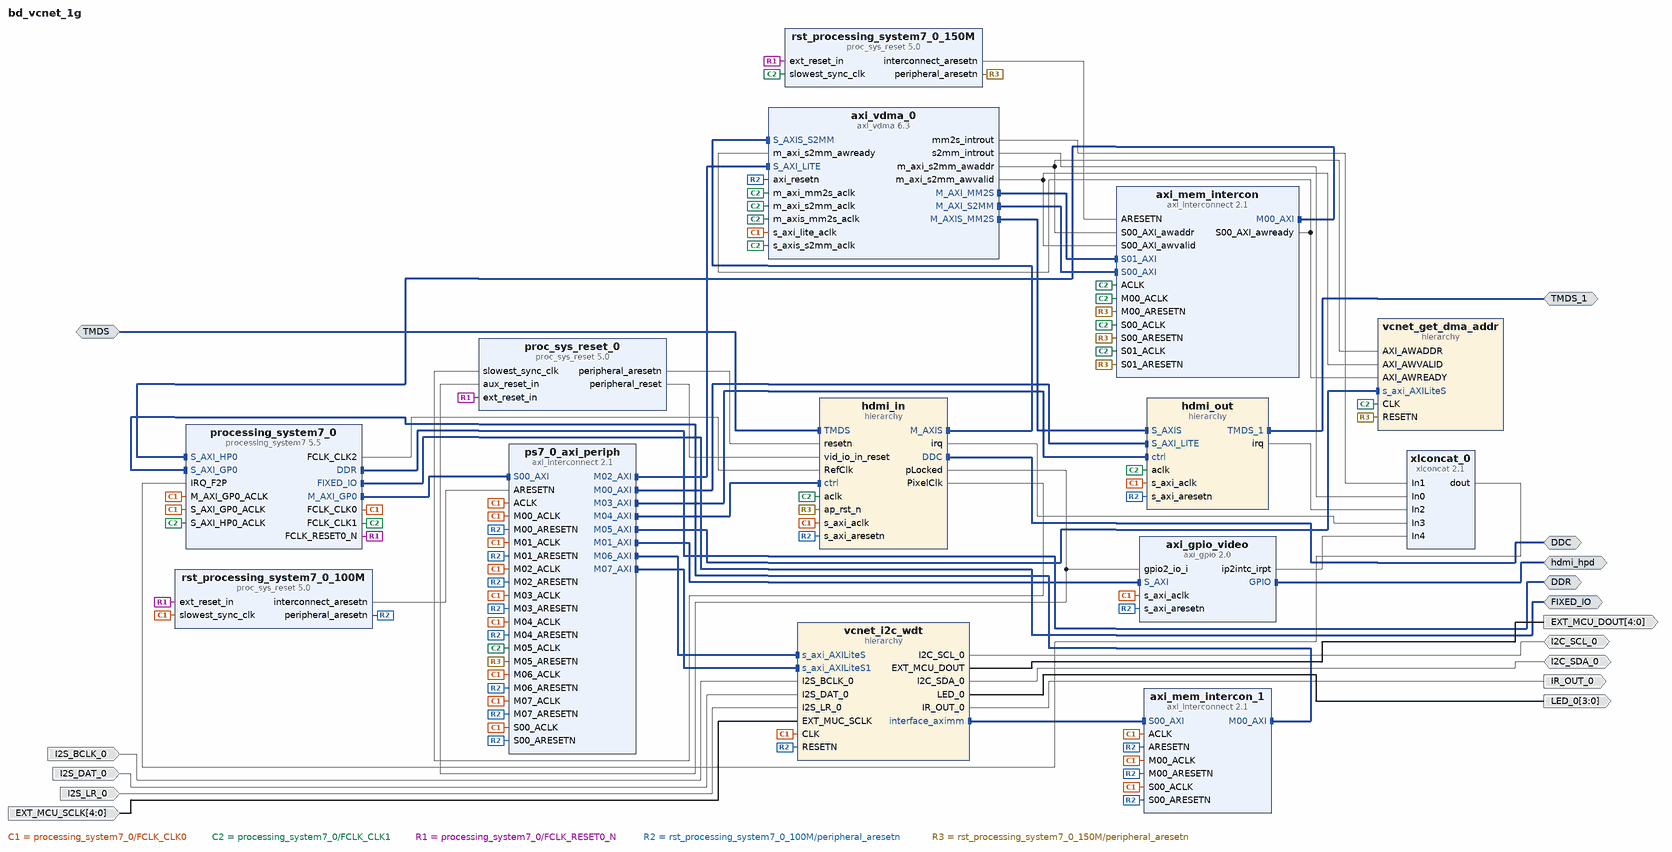
[diagram p0: block diagram of the top level]
# Vivado block design bd_vcnet_1g, xc7z010clg400-1, Vivado 2021.2
create_bd_design bd_vcnet_1g

create_bd_intf_port -mode Master -vlnv xilinx.com:interface:iic_rtl:1.0 DDC
create_bd_intf_port -mode Master -vlnv xilinx.com:interface:ddrx_rtl:1.0 DDR
create_bd_intf_port -mode Master -vlnv xilinx.com:display_processing_system7:fixedio_rtl:1.0 FIXED_IO
create_bd_intf_port -mode Slave -vlnv digilentinc.com:interface:tmds_rtl:1.0 TMDS
create_bd_intf_port -mode Master -vlnv digilentinc.com:interface:tmds_rtl:1.0 TMDS_1
create_bd_intf_port -mode Master -vlnv xilinx.com:interface:gpio_rtl:1.0 hdmi_hpd
create_bd_port -dir O -from 4 -to 0 EXT_MCU_DOUT
create_bd_port -dir I -from 4 -to 0 EXT_MCU_SCLK
create_bd_port -dir IO I2C_SCL_0
create_bd_port -dir IO I2C_SDA_0
create_bd_port -dir I I2S_BCLK_0
create_bd_port -dir I I2S_DAT_0
create_bd_port -dir I I2S_LR_0
create_bd_port -dir O IR_OUT_0
create_bd_port -dir O -from 3 -to 0 LED_0

create_bd_cell -type ip -vlnv xilinx.com:ip:axi_gpio:2.0 axi_gpio_video
set_property -dict [list \
  CONFIG.C_ALL_INPUTS_2 1 \
  CONFIG.C_ALL_OUTPUTS 1 \
  CONFIG.C_GPIO2_WIDTH 1 \
  CONFIG.C_GPIO_WIDTH 1 \
  CONFIG.C_INTERRUPT_PRESENT 1 \
  CONFIG.C_IS_DUAL 1 \
] [get_bd_cells axi_gpio_video]
create_bd_cell -type ip -vlnv xilinx.com:ip:axi_interconnect:2.1 axi_mem_intercon
set_property -dict [list \
  CONFIG.M00_HAS_DATA_FIFO 2 \
  CONFIG.M00_HAS_REGSLICE 4 \
  CONFIG.NUM_MI 1 \
  CONFIG.NUM_SI 2 \
  CONFIG.S00_HAS_DATA_FIFO 2 \
  CONFIG.S00_HAS_REGSLICE 4 \
  CONFIG.S01_HAS_DATA_FIFO 2 \
  CONFIG.S01_HAS_REGSLICE 4 \
  CONFIG.STRATEGY 0 \
  CONFIG.SYNCHRONIZATION_STAGES 2 \
] [get_bd_cells axi_mem_intercon]
create_bd_cell -type ip -vlnv xilinx.com:ip:axi_interconnect:2.1 axi_mem_intercon_1
set_property -dict {CONFIG.NUM_MI 1} [get_bd_cells axi_mem_intercon_1]
create_bd_cell -type ip -vlnv xilinx.com:ip:axi_vdma:6.3 axi_vdma_0
set_property -dict [list \
  CONFIG.c_include_mm2s_dre 0 \
  CONFIG.c_include_s2mm_dre 0 \
  CONFIG.c_m_axi_mm2s_data_width 32 \
  CONFIG.c_m_axis_mm2s_tdata_width 24 \
  CONFIG.c_mm2s_genlock_mode 0 \
  CONFIG.c_mm2s_linebuffer_depth 2048 \
  CONFIG.c_mm2s_max_burst_length 32 \
  CONFIG.c_num_fstores 3 \
  CONFIG.c_s2mm_genlock_mode 0 \
  CONFIG.c_s2mm_linebuffer_depth 2048 \
  CONFIG.c_s2mm_max_burst_length 32 \
  CONFIG.c_use_s2mm_fsync 2 \
] [get_bd_cells axi_vdma_0]
create_bd_cell -type hier hdmi_in
create_bd_cell -type hier hdmi_out
create_bd_cell -type ip -vlnv xilinx.com:ip:proc_sys_reset:5.0 proc_sys_reset_0
set_property -dict {CONFIG.C_AUX_RESET_HIGH 0 CONFIG.C_EXT_RST_WIDTH 4} [get_bd_cells proc_sys_reset_0]
create_bd_cell -type ip -vlnv xilinx.com:ip:processing_system7:5.5 processing_system7_0
set_property -dict [list \
  CONFIG.PCW_APU_PERIPHERAL_FREQMHZ 650 \
  CONFIG.PCW_CRYSTAL_PERIPHERAL_FREQMHZ 50.000000 \
  CONFIG.PCW_ENET0_ENET0_IO {MIO 16 .. 27} \
  CONFIG.PCW_ENET0_GRP_MDIO_ENABLE 1 \
  CONFIG.PCW_ENET0_GRP_MDIO_IO {MIO 52 .. 53} \
  CONFIG.PCW_ENET0_PERIPHERAL_ENABLE 1 \
  CONFIG.PCW_ENET0_RESET_ENABLE 1 \
  CONFIG.PCW_ENET0_RESET_IO {MIO 9} \
  CONFIG.PCW_ENET_RESET_ENABLE 1 \
  CONFIG.PCW_ENET_RESET_SELECT {Share reset pin} \
  CONFIG.PCW_EN_CLK1_PORT 1 \
  CONFIG.PCW_EN_CLK2_PORT 1 \
  CONFIG.PCW_FCLK_CLK1_BUF TRUE \
  CONFIG.PCW_FCLK_CLK2_BUF TRUE \
  CONFIG.PCW_FPGA0_PERIPHERAL_FREQMHZ 100 \
  CONFIG.PCW_FPGA1_PERIPHERAL_FREQMHZ 140 \
  CONFIG.PCW_FPGA2_PERIPHERAL_FREQMHZ 200 \
  CONFIG.PCW_FPGA_FCLK1_ENABLE 1 \
  CONFIG.PCW_FPGA_FCLK2_ENABLE 1 \
  CONFIG.PCW_GP0_EN_MODIFIABLE_TXN 0 \
  CONFIG.PCW_GP1_EN_MODIFIABLE_TXN 0 \
  CONFIG.PCW_GPIO_MIO_GPIO_ENABLE 1 \
  CONFIG.PCW_GPIO_MIO_GPIO_IO MIO \
  CONFIG.PCW_I2C0_I2C0_IO EMIO \
  CONFIG.PCW_I2C0_PERIPHERAL_ENABLE 1 \
  CONFIG.PCW_I2C1_I2C1_IO EMIO \
  CONFIG.PCW_I2C1_PERIPHERAL_ENABLE 1 \
  CONFIG.PCW_I2C_PERIPHERAL_FREQMHZ 108.333336 \
  CONFIG.PCW_I2C_RESET_ENABLE 1 \
  CONFIG.PCW_I2C_RESET_SELECT {Share reset pin} \
  CONFIG.PCW_IRQ_F2P_INTR 1 \
  CONFIG.PCW_PERIPHERAL_BOARD_PRESET part0 \
  CONFIG.PCW_PRESET_BANK1_VOLTAGE {LVCMOS 1.8V} \
  CONFIG.PCW_QSPI_GRP_FBCLK_ENABLE 1 \
  CONFIG.PCW_QSPI_GRP_FBCLK_IO {MIO 8} \
  CONFIG.PCW_QSPI_GRP_SINGLE_SS_ENABLE 1 \
  CONFIG.PCW_QSPI_GRP_SINGLE_SS_IO {MIO 1 .. 6} \
  CONFIG.PCW_QSPI_PERIPHERAL_ENABLE 1 \
  CONFIG.PCW_QSPI_QSPI_IO {MIO 1 .. 6} \
  CONFIG.PCW_SD0_GRP_CD_ENABLE 1 \
  CONFIG.PCW_SD0_GRP_CD_IO {MIO 47} \
  CONFIG.PCW_SD0_GRP_WP_ENABLE 1 \
  CONFIG.PCW_SD0_GRP_WP_IO EMIO \
  CONFIG.PCW_SD0_PERIPHERAL_ENABLE 1 \
  CONFIG.PCW_SD0_SD0_IO {MIO 40 .. 45} \
  CONFIG.PCW_SDIO_PERIPHERAL_FREQMHZ 50 \
  CONFIG.PCW_SINGLE_QSPI_DATA_MODE x4 \
  CONFIG.PCW_UART0_PERIPHERAL_ENABLE 1 \
  CONFIG.PCW_UART0_UART0_IO {MIO 14 .. 15} \
  CONFIG.PCW_UART1_PERIPHERAL_ENABLE 0 \
  CONFIG.PCW_UART_PERIPHERAL_FREQMHZ 100 \
  CONFIG.PCW_UIPARAM_DDR_BUS_WIDTH {16 Bit} \
  CONFIG.PCW_UIPARAM_DDR_FREQ_MHZ 525 \
  CONFIG.PCW_UIPARAM_DDR_PARTNO {MT41K256M16 RE-125} \
  CONFIG.PCW_USB0_PERIPHERAL_ENABLE 1 \
  CONFIG.PCW_USB0_RESET_ENABLE 1 \
  CONFIG.PCW_USB0_RESET_IO {MIO 46} \
  CONFIG.PCW_USB0_USB0_IO {MIO 28 .. 39} \
  CONFIG.PCW_USB_RESET_ENABLE 1 \
  CONFIG.PCW_USB_RESET_SELECT {Share reset pin} \
  CONFIG.PCW_USE_FABRIC_INTERRUPT 1 \
  CONFIG.PCW_USE_S_AXI_GP0 1 \
  CONFIG.PCW_USE_S_AXI_HP0 1 \
  CONFIG.preset Default \
] [get_bd_cells processing_system7_0]
# 508 more settings of processing_system7_0 are not shown: defaults, MIO pin electricals, DDR timing, and values the tool derives
create_bd_cell -type ip -vlnv xilinx.com:ip:axi_interconnect:2.1 ps7_0_axi_periph
set_property -dict {CONFIG.NUM_MI 8 CONFIG.SYNCHRONIZATION_STAGES 2} [get_bd_cells ps7_0_axi_periph]
create_bd_cell -type ip -vlnv xilinx.com:ip:proc_sys_reset:5.0 rst_processing_system7_0_100M
create_bd_cell -type ip -vlnv xilinx.com:ip:proc_sys_reset:5.0 rst_processing_system7_0_150M
create_bd_cell -type hier vcnet_get_dma_addr
create_bd_cell -type hier vcnet_i2c_wdt
create_bd_cell -type ip -vlnv xilinx.com:ip:xlconcat:2.1 xlconcat_0
set_property -dict {CONFIG.NUM_PORTS 5 CONFIG.dout_width 5} [get_bd_cells xlconcat_0]

# ---- hierarchy /hdmi_in ----
current_bd_instance /hdmi_in
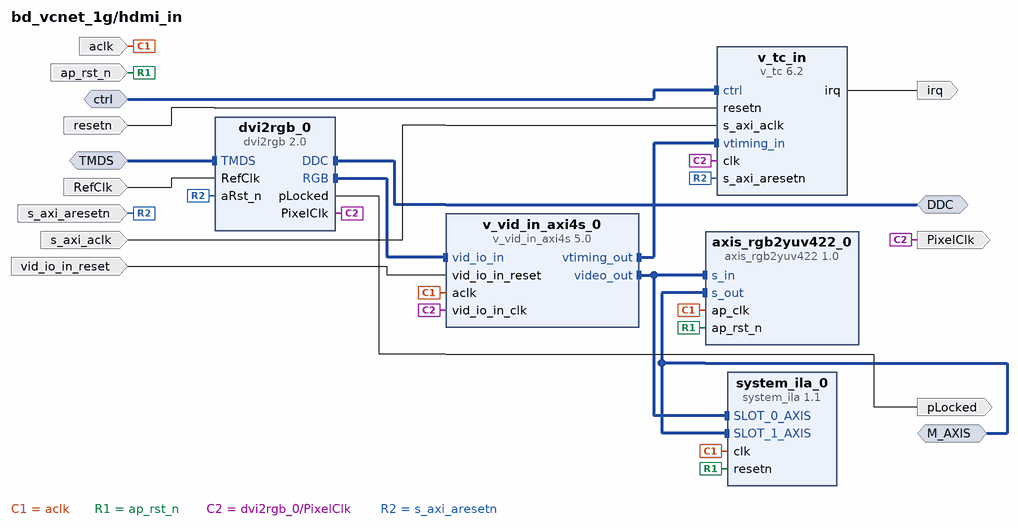
[diagram p1: block diagram inside /hdmi_in]
create_bd_intf_pin -mode Master -vlnv xilinx.com:interface:axis_rtl:1.0 M_AXIS
create_bd_intf_pin -mode Slave -vlnv xilinx.com:interface:aximm_rtl:1.0 ctrl
create_bd_intf_pin -mode Slave -vlnv digilentinc.com:interface:tmds_rtl:1.0 TMDS
create_bd_intf_pin -mode Master -vlnv xilinx.com:interface:iic_rtl:1.0 DDC
create_bd_pin -dir I -type clk aclk
create_bd_pin -dir I -type clk s_axi_aclk
create_bd_pin -dir I -type rst s_axi_aresetn
create_bd_pin -dir O -type intr irq
create_bd_pin -dir I -type rst resetn
create_bd_pin -dir I -type rst vid_io_in_reset
create_bd_pin -dir I -type clk RefClk
create_bd_pin -dir O pLocked
create_bd_pin -dir O -type clk PixelClk
create_bd_pin -dir I -type rst ap_rst_n

create_bd_cell -type ip -vlnv xilinx.com:ip:v_tc:6.2 v_tc_in
set_property -dict [list \
  CONFIG.HAS_INTC_IF true \
  CONFIG.VIDEO_MODE 720p \
  CONFIG.enable_generation false \
  CONFIG.horizontal_blank_detection false \
  CONFIG.max_lines_per_frame 2048 \
  CONFIG.vertical_blank_detection false \
] [get_bd_cells v_tc_in]
create_bd_cell -type ip -vlnv xilinx.com:ip:v_vid_in_axi4s:5.0 v_vid_in_axi4s_0
set_property -dict {CONFIG.C_ADDR_WIDTH 12 CONFIG.C_HAS_ASYNC_CLK 1} [get_bd_cells v_vid_in_axi4s_0]
create_bd_cell -type ip -vlnv digilentinc.com:ip:dvi2rgb:2.0 dvi2rgb_0
set_property -dict [list \
  CONFIG.kAddBUFG false \
  CONFIG.kDebug false \
  CONFIG.kEmulateDDC true \
  CONFIG.kEnableSerialClkOutput false \
  CONFIG.kRstActiveHigh false \
] [get_bd_cells dvi2rgb_0]
create_bd_cell -type ip -vlnv xilinx.com:hls:axis_rgb2yuv422:1.0 axis_rgb2yuv422_0
create_bd_cell -type ip -vlnv xilinx.com:ip:system_ila:1.1 system_ila_0
set_property -dict [list \
  CONFIG.C_DATA_DEPTH 4096 \
  CONFIG.C_NUM_MONITOR_SLOTS 2 \
  CONFIG.C_SLOT 1 \
  CONFIG.C_SLOT_0_INTF_TYPE xilinx.com:interface:axis_rtl:1.0 \
  CONFIG.C_SLOT_1_INTF_TYPE xilinx.com:interface:axis_rtl:1.0 \
] [get_bd_cells system_ila_0]

# ---- hierarchy /hdmi_out ----
current_bd_instance /hdmi_out
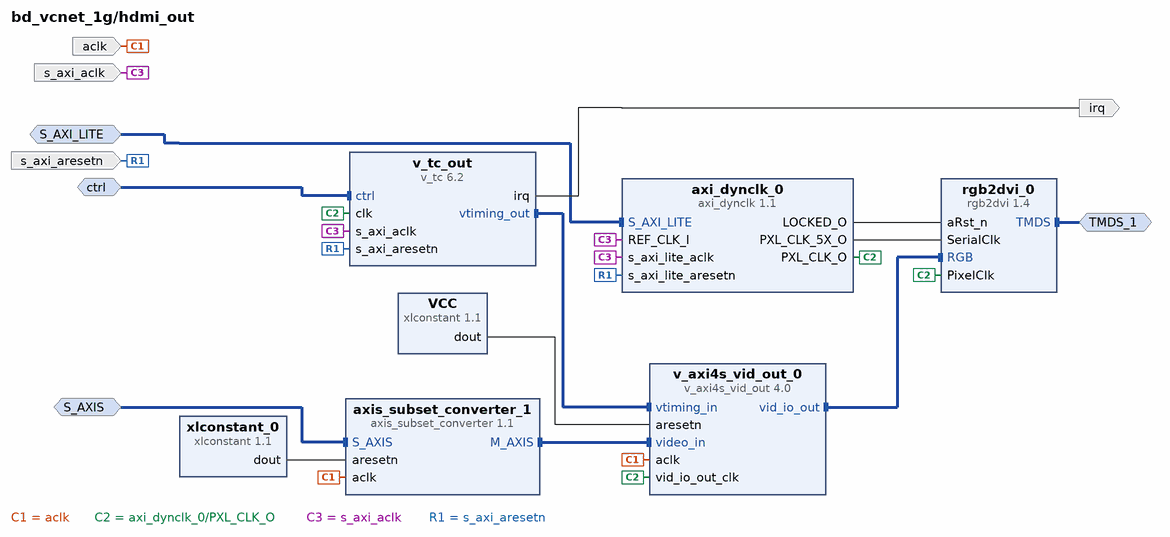
[diagram p2: block diagram inside /hdmi_out]
create_bd_intf_pin -mode Slave -vlnv xilinx.com:interface:axis_rtl:1.0 S_AXIS
create_bd_intf_pin -mode Slave -vlnv xilinx.com:interface:aximm_rtl:1.0 ctrl
create_bd_intf_pin -mode Master -vlnv digilentinc.com:interface:tmds_rtl:1.0 TMDS_1
create_bd_intf_pin -mode Slave -vlnv xilinx.com:interface:aximm_rtl:1.0 S_AXI_LITE
create_bd_pin -dir I -type clk aclk
create_bd_pin -dir I -type clk s_axi_aclk
create_bd_pin -dir I -type rst s_axi_aresetn
create_bd_pin -dir O -type intr irq

create_bd_cell -type ip -vlnv xilinx.com:ip:axis_subset_converter:1.1 axis_subset_converter_1
set_property -dict [list \
  CONFIG.M_HAS_TKEEP 1 \
  CONFIG.M_HAS_TLAST 1 \
  CONFIG.M_TDATA_NUM_BYTES 3 \
  CONFIG.M_TUSER_WIDTH 1 \
  CONFIG.S_HAS_TKEEP 1 \
  CONFIG.S_HAS_TLAST 1 \
  CONFIG.S_TDATA_NUM_BYTES 3 \
  CONFIG.S_TUSER_WIDTH 1 \
  CONFIG.TDATA_REMAP {tdata[23:16],tdata[7:0],tdata[15:8]} \
  CONFIG.TKEEP_REMAP {tkeep[2:0]} \
  CONFIG.TLAST_REMAP {tlast[0]} \
  CONFIG.TUSER_REMAP {tuser[0:0]} \
] [get_bd_cells axis_subset_converter_1]
create_bd_cell -type ip -vlnv xilinx.com:ip:v_tc:6.2 v_tc_out
set_property -dict {CONFIG.enable_detection false} [get_bd_cells v_tc_out]
create_bd_cell -type ip -vlnv xilinx.com:ip:v_axi4s_vid_out:4.0 v_axi4s_vid_out_0
set_property -dict [list \
  CONFIG.C_ADDR_WIDTH 5 \
  CONFIG.C_HAS_ASYNC_CLK 1 \
  CONFIG.C_S_AXIS_VIDEO_DATA_WIDTH 8 \
  CONFIG.C_S_AXIS_VIDEO_FORMAT 2 \
  CONFIG.C_VTG_MASTER_SLAVE 1 \
] [get_bd_cells v_axi4s_vid_out_0]
create_bd_cell -type ip -vlnv digilentinc.com:ip:rgb2dvi:1.4 rgb2dvi_0
set_property -dict {CONFIG.kGenerateSerialClk false CONFIG.kRstActiveHigh false} [get_bd_cells rgb2dvi_0]
create_bd_cell -type ip -vlnv xilinx.com:ip:xlconstant:1.1 VCC
create_bd_cell -type ip -vlnv xilinx.com:ip:xlconstant:1.1 xlconstant_0
create_bd_cell -type ip -vlnv digilentinc.com:ip:axi_dynclk:1.1 axi_dynclk_0

# ---- hierarchy /vcnet_get_dma_addr ----
current_bd_instance /vcnet_get_dma_addr
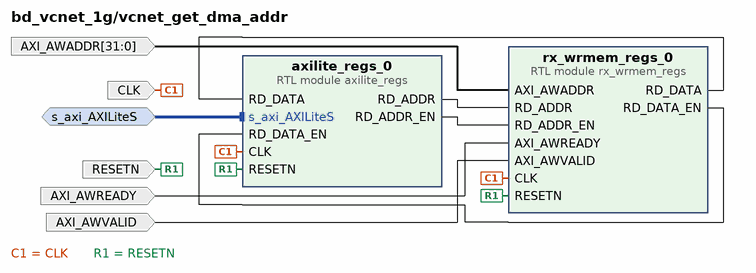
[diagram p3: block diagram inside /vcnet_get_dma_addr]
create_bd_intf_pin -mode Slave -vlnv xilinx.com:interface:aximm_rtl:1.0 s_axi_AXILiteS
create_bd_pin -dir I -type clk CLK
create_bd_pin -dir I -type rst RESETN
create_bd_pin -dir I AXI_AWREADY
create_bd_pin -dir I AXI_AWVALID
create_bd_pin -dir I -from 31 -to 0 AXI_AWADDR

create_bd_cell -type module -reference axilite_regs axilite_regs_0
create_bd_cell -type module -reference rx_wrmem_regs rx_wrmem_regs_0

# ---- hierarchy /vcnet_i2c_wdt ----
current_bd_instance /vcnet_i2c_wdt
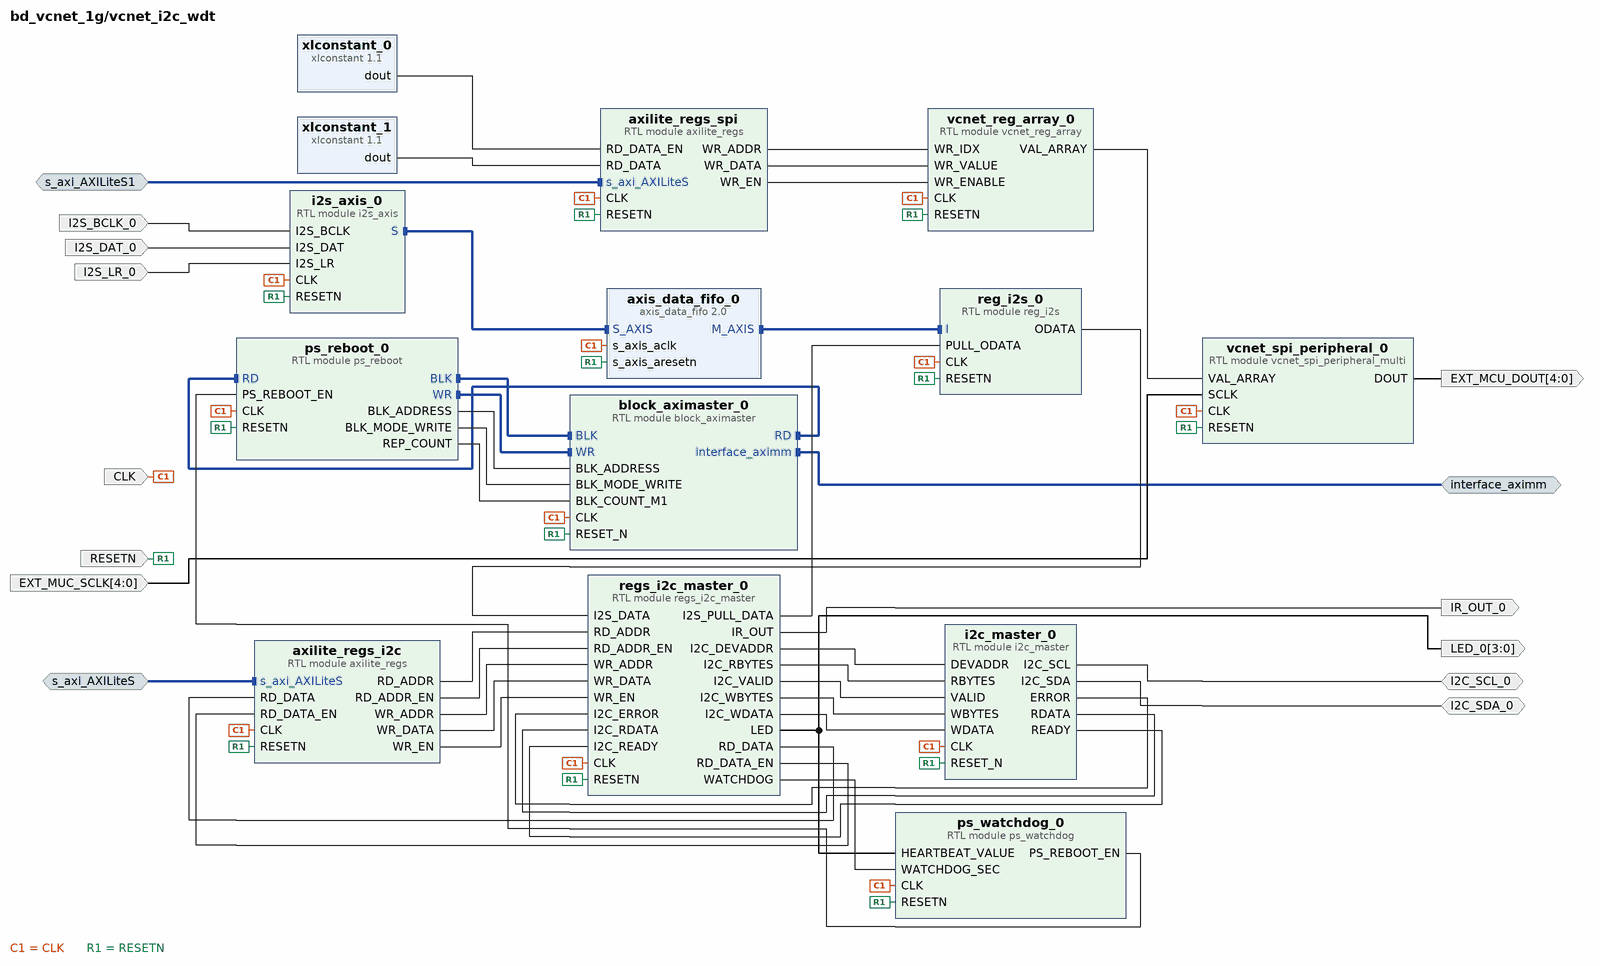
[diagram p4: block diagram inside /vcnet_i2c_wdt]
create_bd_intf_pin -mode Master -vlnv xilinx.com:interface:aximm_rtl:1.0 interface_aximm
create_bd_intf_pin -mode Slave -vlnv xilinx.com:interface:aximm_rtl:1.0 s_axi_AXILiteS
create_bd_intf_pin -mode Slave -vlnv xilinx.com:interface:aximm_rtl:1.0 s_axi_AXILiteS1
create_bd_pin -dir I -type clk CLK
create_bd_pin -dir I -type rst RESETN
create_bd_pin -dir O -from 3 -to 0 LED_0
create_bd_pin -dir IO I2C_SCL_0
create_bd_pin -dir IO I2C_SDA_0
create_bd_pin -dir I I2S_BCLK_0
create_bd_pin -dir I I2S_LR_0
create_bd_pin -dir I I2S_DAT_0
create_bd_pin -dir O IR_OUT_0
create_bd_pin -dir I -from 4 -to 0 EXT_MUC_SCLK
create_bd_pin -dir O -from 4 -to 0 EXT_MCU_DOUT

create_bd_cell -type module -reference axilite_regs axilite_regs_i2c
create_bd_cell -type ip -vlnv xilinx.com:ip:axis_data_fifo:2.0 axis_data_fifo_0
set_property -dict {CONFIG.FIFO_DEPTH 8192} [get_bd_cells axis_data_fifo_0]
create_bd_cell -type module -reference axilite_regs axilite_regs_spi
create_bd_cell -type ip -vlnv xilinx.com:ip:xlconstant:1.1 xlconstant_0
set_property -dict {CONFIG.CONST_VAL 0} [get_bd_cells xlconstant_0]
create_bd_cell -type ip -vlnv xilinx.com:ip:xlconstant:1.1 xlconstant_1
set_property -dict {CONFIG.CONST_VAL 0 CONFIG.CONST_WIDTH 32} [get_bd_cells xlconstant_1]
create_bd_cell -type module -reference ps_watchdog ps_watchdog_0
create_bd_cell -type module -reference ps_reboot ps_reboot_0
create_bd_cell -type module -reference regs_i2c_master regs_i2c_master_0
create_bd_cell -type module -reference vcnet_reg_array vcnet_reg_array_0
create_bd_cell -type module -reference i2c_master i2c_master_0
create_bd_cell -type module -reference block_aximaster block_aximaster_0
create_bd_cell -type module -reference i2s_axis i2s_axis_0
create_bd_cell -type module -reference reg_i2s reg_i2s_0
create_bd_cell -type module -reference vcnet_spi_peripheral_multi vcnet_spi_peripheral_0

# ---- connections ----

current_bd_instance /hdmi_in
connect_bd_intf_net [get_bd_intf_pins TMDS] [get_bd_intf_pins dvi2rgb_0/TMDS]
connect_bd_intf_net [get_bd_intf_pins ctrl] [get_bd_intf_pins v_tc_in/ctrl]
connect_bd_intf_net [get_bd_intf_pins DDC] [get_bd_intf_pins dvi2rgb_0/DDC]
connect_bd_intf_net [get_bd_intf_pins M_AXIS] [get_bd_intf_pins axis_rgb2yuv422_0/s_out]
connect_bd_intf_net [get_bd_intf_pins M_AXIS] [get_bd_intf_pins system_ila_0/SLOT_1_AXIS]
connect_bd_intf_net [get_bd_intf_pins v_vid_in_axi4s_0/vid_io_in] [get_bd_intf_pins dvi2rgb_0/RGB]
connect_bd_intf_net [get_bd_intf_pins axis_rgb2yuv422_0/s_in] [get_bd_intf_pins v_vid_in_axi4s_0/video_out]
connect_bd_intf_net [get_bd_intf_pins axis_rgb2yuv422_0/s_in] [get_bd_intf_pins system_ila_0/SLOT_0_AXIS]
connect_bd_intf_net [get_bd_intf_pins v_tc_in/vtiming_in] [get_bd_intf_pins v_vid_in_axi4s_0/vtiming_out]
connect_bd_net [get_bd_pins RefClk] [get_bd_pins dvi2rgb_0/RefClk]
connect_bd_net [get_bd_pins aclk] [get_bd_pins v_vid_in_axi4s_0/aclk] [get_bd_pins axis_rgb2yuv422_0/ap_clk] [get_bd_pins system_ila_0/clk]
connect_bd_net [get_bd_pins ap_rst_n] [get_bd_pins axis_rgb2yuv422_0/ap_rst_n] [get_bd_pins system_ila_0/resetn]
connect_bd_net -net clk_1 [get_bd_pins dvi2rgb_0/PixelClk] \
  [get_bd_pins v_tc_in/clk] [get_bd_pins v_vid_in_axi4s_0/vid_io_in_clk] [get_bd_pins PixelClk]
connect_bd_net [get_bd_pins dvi2rgb_0/pLocked] [get_bd_pins pLocked]
connect_bd_net [get_bd_pins resetn] [get_bd_pins v_tc_in/resetn]
connect_bd_net [get_bd_pins s_axi_aclk] [get_bd_pins v_tc_in/s_axi_aclk]
connect_bd_net [get_bd_pins s_axi_aresetn] [get_bd_pins v_tc_in/s_axi_aresetn] [get_bd_pins dvi2rgb_0/aRst_n]
connect_bd_net -net v_tc_1_irq [get_bd_pins v_tc_in/irq] [get_bd_pins irq]
connect_bd_net [get_bd_pins vid_io_in_reset] [get_bd_pins v_vid_in_axi4s_0/vid_io_in_reset]

current_bd_instance /hdmi_out
connect_bd_intf_net [get_bd_intf_pins TMDS_1] [get_bd_intf_pins rgb2dvi_0/TMDS]
connect_bd_intf_net [get_bd_intf_pins S_AXIS] [get_bd_intf_pins axis_subset_converter_1/S_AXIS]
connect_bd_intf_net [get_bd_intf_pins S_AXI_LITE] [get_bd_intf_pins axi_dynclk_0/S_AXI_LITE]
connect_bd_intf_net [get_bd_intf_pins ctrl] [get_bd_intf_pins v_tc_out/ctrl]
connect_bd_intf_net [get_bd_intf_pins axis_subset_converter_1/M_AXIS] [get_bd_intf_pins v_axi4s_vid_out_0/video_in]
connect_bd_intf_net [get_bd_intf_pins v_axi4s_vid_out_0/vid_io_out] [get_bd_intf_pins rgb2dvi_0/RGB]
connect_bd_intf_net -intf_net v_tc_0_vtiming_out [get_bd_intf_pins v_tc_out/vtiming_out] [get_bd_intf_pins v_axi4s_vid_out_0/vtiming_in]
connect_bd_net [get_bd_pins VCC/dout] [get_bd_pins v_axi4s_vid_out_0/aresetn]
connect_bd_net [get_bd_pins aclk] [get_bd_pins axis_subset_converter_1/aclk] [get_bd_pins v_axi4s_vid_out_0/aclk]
connect_bd_net [get_bd_pins axi_dynclk_0/LOCKED_O] [get_bd_pins rgb2dvi_0/aRst_n]
connect_bd_net [get_bd_pins axi_dynclk_0/PXL_CLK_5X_O] [get_bd_pins rgb2dvi_0/SerialClk]
connect_bd_net -net clk_1 [get_bd_pins axi_dynclk_0/PXL_CLK_O] \
  [get_bd_pins v_tc_out/clk] [get_bd_pins v_axi4s_vid_out_0/vid_io_out_clk] [get_bd_pins rgb2dvi_0/PixelClk]
connect_bd_net [get_bd_pins s_axi_aclk] \
  [get_bd_pins v_tc_out/s_axi_aclk] [get_bd_pins axi_dynclk_0/s_axi_lite_aclk] [get_bd_pins axi_dynclk_0/REF_CLK_I]
connect_bd_net [get_bd_pins s_axi_aresetn] [get_bd_pins v_tc_out/s_axi_aresetn] [get_bd_pins axi_dynclk_0/s_axi_lite_aresetn]
connect_bd_net -net v_tc_0_irq [get_bd_pins v_tc_out/irq] [get_bd_pins irq]
connect_bd_net [get_bd_pins xlconstant_0/dout] [get_bd_pins axis_subset_converter_1/aresetn]

current_bd_instance /vcnet_get_dma_addr
connect_bd_intf_net [get_bd_intf_pins s_axi_AXILiteS] [get_bd_intf_pins axilite_regs_0/s_axi_AXILiteS]
connect_bd_net [get_bd_pins AXI_AWADDR] [get_bd_pins rx_wrmem_regs_0/AXI_AWADDR]
connect_bd_net [get_bd_pins AXI_AWREADY] [get_bd_pins rx_wrmem_regs_0/AXI_AWREADY]
connect_bd_net [get_bd_pins AXI_AWVALID] [get_bd_pins rx_wrmem_regs_0/AXI_AWVALID]
connect_bd_net [get_bd_pins CLK] [get_bd_pins axilite_regs_0/CLK] [get_bd_pins rx_wrmem_regs_0/CLK]
connect_bd_net [get_bd_pins RESETN] [get_bd_pins axilite_regs_0/RESETN] [get_bd_pins rx_wrmem_regs_0/RESETN]
connect_bd_net [get_bd_pins axilite_regs_0/RD_ADDR] [get_bd_pins rx_wrmem_regs_0/RD_ADDR]
connect_bd_net [get_bd_pins axilite_regs_0/RD_ADDR_EN] [get_bd_pins rx_wrmem_regs_0/RD_ADDR_EN]
connect_bd_net [get_bd_pins rx_wrmem_regs_0/RD_DATA] [get_bd_pins axilite_regs_0/RD_DATA]
connect_bd_net [get_bd_pins rx_wrmem_regs_0/RD_DATA_EN] [get_bd_pins axilite_regs_0/RD_DATA_EN]

current_bd_instance /vcnet_i2c_wdt
connect_bd_intf_net [get_bd_intf_pins s_axi_AXILiteS1] [get_bd_intf_pins axilite_regs_spi/s_axi_AXILiteS]
connect_bd_intf_net [get_bd_intf_pins s_axi_AXILiteS] [get_bd_intf_pins axilite_regs_i2c/s_axi_AXILiteS]
connect_bd_intf_net [get_bd_intf_pins axis_data_fifo_0/M_AXIS] [get_bd_intf_pins reg_i2s_0/I]
connect_bd_intf_net [get_bd_intf_pins ps_reboot_0/RD] [get_bd_intf_pins block_aximaster_0/RD]
connect_bd_intf_net [get_bd_intf_pins interface_aximm] [get_bd_intf_pins block_aximaster_0/interface_aximm]
connect_bd_intf_net [get_bd_intf_pins i2s_axis_0/S] [get_bd_intf_pins axis_data_fifo_0/S_AXIS]
connect_bd_intf_net [get_bd_intf_pins ps_reboot_0/BLK] [get_bd_intf_pins block_aximaster_0/BLK]
connect_bd_intf_net [get_bd_intf_pins block_aximaster_0/WR] [get_bd_intf_pins ps_reboot_0/WR]
connect_bd_net [get_bd_pins CLK] \
  [get_bd_pins axilite_regs_i2c/CLK] [get_bd_pins axis_data_fifo_0/s_axis_aclk] [get_bd_pins axilite_regs_spi/CLK] \
  [get_bd_pins ps_watchdog_0/CLK] [get_bd_pins ps_reboot_0/CLK] [get_bd_pins regs_i2c_master_0/CLK] \
  [get_bd_pins vcnet_reg_array_0/CLK] [get_bd_pins i2c_master_0/CLK] [get_bd_pins block_aximaster_0/CLK] \
  [get_bd_pins i2s_axis_0/CLK] [get_bd_pins reg_i2s_0/CLK] [get_bd_pins vcnet_spi_peripheral_0/CLK]
connect_bd_net -net I2S_BCLK_0_1 [get_bd_pins I2S_BCLK_0] [get_bd_pins i2s_axis_0/I2S_BCLK]
connect_bd_net -net I2S_DAT_0_1 [get_bd_pins I2S_DAT_0] [get_bd_pins i2s_axis_0/I2S_DAT]
connect_bd_net -net I2S_LR_0_1 [get_bd_pins I2S_LR_0] [get_bd_pins i2s_axis_0/I2S_LR]
connect_bd_net [get_bd_pins I2C_SCL_0] [get_bd_pins i2c_master_0/I2C_SCL]
connect_bd_net [get_bd_pins I2C_SDA_0] [get_bd_pins i2c_master_0/I2C_SDA]
connect_bd_net [get_bd_pins RESETN] \
  [get_bd_pins axilite_regs_i2c/RESETN] [get_bd_pins axis_data_fifo_0/s_axis_aresetn] [get_bd_pins axilite_regs_spi/RESETN] \
  [get_bd_pins ps_watchdog_0/RESETN] [get_bd_pins ps_reboot_0/RESETN] [get_bd_pins regs_i2c_master_0/RESETN] \
  [get_bd_pins vcnet_reg_array_0/RESETN] [get_bd_pins i2c_master_0/RESET_N] [get_bd_pins block_aximaster_0/RESET_N] \
  [get_bd_pins i2s_axis_0/RESETN] [get_bd_pins reg_i2s_0/RESETN] [get_bd_pins vcnet_spi_peripheral_0/RESETN]
connect_bd_net -net SCLK_0_1 [get_bd_pins EXT_MUC_SCLK] [get_bd_pins vcnet_spi_peripheral_0/SCLK]
connect_bd_net -net axilite_regs_1_RD_ADDR [get_bd_pins axilite_regs_i2c/RD_ADDR] [get_bd_pins regs_i2c_master_0/RD_ADDR]
connect_bd_net -net axilite_regs_1_RD_ADDR_EN [get_bd_pins axilite_regs_i2c/RD_ADDR_EN] [get_bd_pins regs_i2c_master_0/RD_ADDR_EN]
connect_bd_net -net axilite_regs_1_WR_ADDR [get_bd_pins axilite_regs_i2c/WR_ADDR] [get_bd_pins regs_i2c_master_0/WR_ADDR]
connect_bd_net -net axilite_regs_1_WR_DATA [get_bd_pins axilite_regs_i2c/WR_DATA] [get_bd_pins regs_i2c_master_0/WR_DATA]
connect_bd_net -net axilite_regs_1_WR_EN [get_bd_pins axilite_regs_i2c/WR_EN] [get_bd_pins regs_i2c_master_0/WR_EN]
connect_bd_net [get_bd_pins axilite_regs_spi/WR_ADDR] [get_bd_pins vcnet_reg_array_0/WR_IDX]
connect_bd_net [get_bd_pins axilite_regs_spi/WR_DATA] [get_bd_pins vcnet_reg_array_0/WR_VALUE]
connect_bd_net [get_bd_pins axilite_regs_spi/WR_EN] [get_bd_pins vcnet_reg_array_0/WR_ENABLE]
connect_bd_net [get_bd_pins i2c_master_0/ERROR] [get_bd_pins regs_i2c_master_0/I2C_ERROR]
connect_bd_net [get_bd_pins i2c_master_0/RDATA] [get_bd_pins regs_i2c_master_0/I2C_RDATA]
connect_bd_net [get_bd_pins i2c_master_0/READY] [get_bd_pins regs_i2c_master_0/I2C_READY]
connect_bd_net [get_bd_pins ps_reboot_0/BLK_ADDRESS] [get_bd_pins block_aximaster_0/BLK_ADDRESS]
connect_bd_net [get_bd_pins ps_reboot_0/BLK_MODE_WRITE] [get_bd_pins block_aximaster_0/BLK_MODE_WRITE]
connect_bd_net [get_bd_pins ps_reboot_0/REP_COUNT] [get_bd_pins block_aximaster_0/BLK_COUNT_M1]
connect_bd_net [get_bd_pins ps_watchdog_0/PS_REBOOT_EN] [get_bd_pins ps_reboot_0/PS_REBOOT_EN]
connect_bd_net [get_bd_pins reg_i2s_0/ODATA] [get_bd_pins regs_i2c_master_0/I2S_DATA]
connect_bd_net [get_bd_pins regs_i2c_master_0/I2C_DEVADDR] [get_bd_pins i2c_master_0/DEVADDR]
connect_bd_net [get_bd_pins regs_i2c_master_0/I2C_RBYTES] [get_bd_pins i2c_master_0/RBYTES]
connect_bd_net [get_bd_pins regs_i2c_master_0/I2C_VALID] [get_bd_pins i2c_master_0/VALID]
connect_bd_net [get_bd_pins regs_i2c_master_0/I2C_WBYTES] [get_bd_pins i2c_master_0/WBYTES]
connect_bd_net [get_bd_pins regs_i2c_master_0/I2C_WDATA] [get_bd_pins i2c_master_0/WDATA]
connect_bd_net [get_bd_pins regs_i2c_master_0/I2S_PULL_DATA] [get_bd_pins reg_i2s_0/PULL_ODATA]
connect_bd_net [get_bd_pins regs_i2c_master_0/IR_OUT] [get_bd_pins IR_OUT_0]
connect_bd_net [get_bd_pins regs_i2c_master_0/LED] [get_bd_pins LED_0] [get_bd_pins ps_watchdog_0/HEARTBEAT_VALUE]
connect_bd_net [get_bd_pins regs_i2c_master_0/RD_DATA] [get_bd_pins axilite_regs_i2c/RD_DATA]
connect_bd_net [get_bd_pins regs_i2c_master_0/RD_DATA_EN] [get_bd_pins axilite_regs_i2c/RD_DATA_EN]
connect_bd_net [get_bd_pins regs_i2c_master_0/WATCHDOG] [get_bd_pins ps_watchdog_0/WATCHDOG_SEC]
connect_bd_net [get_bd_pins vcnet_reg_array_0/VAL_ARRAY] [get_bd_pins vcnet_spi_peripheral_0/VAL_ARRAY]
connect_bd_net [get_bd_pins vcnet_spi_peripheral_0/DOUT] [get_bd_pins EXT_MCU_DOUT]
connect_bd_net [get_bd_pins xlconstant_0/dout] [get_bd_pins axilite_regs_spi/RD_DATA_EN]
connect_bd_net [get_bd_pins xlconstant_1/dout] [get_bd_pins axilite_regs_spi/RD_DATA]

current_bd_instance /
connect_bd_intf_net [get_bd_intf_pins axi_mem_intercon_1/S00_AXI] [get_bd_intf_pins vcnet_i2c_wdt/interface_aximm]
connect_bd_intf_net [get_bd_intf_ports TMDS] [get_bd_intf_pins hdmi_in/TMDS]
connect_bd_intf_net -intf_net axi_gpio_0_GPIO2 [get_bd_intf_ports hdmi_hpd] [get_bd_intf_pins axi_gpio_video/GPIO]
connect_bd_intf_net [get_bd_intf_pins axi_mem_intercon_1/M00_AXI] [get_bd_intf_pins processing_system7_0/S_AXI_GP0]
connect_bd_intf_net [get_bd_intf_pins axi_mem_intercon/M00_AXI] [get_bd_intf_pins processing_system7_0/S_AXI_HP0]
connect_bd_intf_net [get_bd_intf_pins axi_vdma_0/M_AXIS_MM2S] [get_bd_intf_pins hdmi_out/S_AXIS]
connect_bd_intf_net [get_bd_intf_pins axi_mem_intercon/S01_AXI] [get_bd_intf_pins axi_vdma_0/M_AXI_MM2S]
connect_bd_intf_net [get_bd_intf_pins axi_mem_intercon/S00_AXI] [get_bd_intf_pins axi_vdma_0/M_AXI_S2MM]
connect_bd_intf_net [get_bd_intf_ports DDC] [get_bd_intf_pins hdmi_in/DDC]
connect_bd_intf_net [get_bd_intf_pins axi_vdma_0/S_AXIS_S2MM] [get_bd_intf_pins hdmi_in/M_AXIS]
connect_bd_intf_net [get_bd_intf_ports TMDS_1] [get_bd_intf_pins hdmi_out/TMDS_1]
connect_bd_intf_net [get_bd_intf_ports DDR] [get_bd_intf_pins processing_system7_0/DDR]
connect_bd_intf_net [get_bd_intf_ports FIXED_IO] [get_bd_intf_pins processing_system7_0/FIXED_IO]
connect_bd_intf_net [get_bd_intf_pins processing_system7_0/M_AXI_GP0] [get_bd_intf_pins ps7_0_axi_periph/S00_AXI]
connect_bd_intf_net [get_bd_intf_pins ps7_0_axi_periph/M00_AXI] [get_bd_intf_pins hdmi_out/S_AXI_LITE]
connect_bd_intf_net [get_bd_intf_pins axi_gpio_video/S_AXI] [get_bd_intf_pins ps7_0_axi_periph/M01_AXI]
connect_bd_intf_net [get_bd_intf_pins axi_vdma_0/S_AXI_LITE] [get_bd_intf_pins ps7_0_axi_periph/M02_AXI]
connect_bd_intf_net [get_bd_intf_pins ps7_0_axi_periph/M03_AXI] [get_bd_intf_pins hdmi_out/ctrl]
connect_bd_intf_net [get_bd_intf_pins ps7_0_axi_periph/M04_AXI] [get_bd_intf_pins hdmi_in/ctrl]
connect_bd_intf_net [get_bd_intf_pins ps7_0_axi_periph/M05_AXI] [get_bd_intf_pins vcnet_get_dma_addr/s_axi_AXILiteS]
connect_bd_intf_net [get_bd_intf_pins ps7_0_axi_periph/M06_AXI] [get_bd_intf_pins vcnet_i2c_wdt/s_axi_AXILiteS]
connect_bd_intf_net [get_bd_intf_pins ps7_0_axi_periph/M07_AXI] [get_bd_intf_pins vcnet_i2c_wdt/s_axi_AXILiteS1]
connect_bd_net -net I2S_BCLK_0_1 [get_bd_ports I2S_BCLK_0] [get_bd_pins vcnet_i2c_wdt/I2S_BCLK_0]
connect_bd_net -net I2S_DAT_0_1 [get_bd_ports I2S_DAT_0] [get_bd_pins vcnet_i2c_wdt/I2S_DAT_0]
connect_bd_net -net I2S_LR_0_1 [get_bd_ports I2S_LR_0] [get_bd_pins vcnet_i2c_wdt/I2S_LR_0]
connect_bd_net [get_bd_ports I2C_SCL_0] [get_bd_pins vcnet_i2c_wdt/I2C_SCL_0]
connect_bd_net [get_bd_ports I2C_SDA_0] [get_bd_pins vcnet_i2c_wdt/I2C_SDA_0]
connect_bd_net -net SCLK_0_1 [get_bd_ports EXT_MCU_SCLK] [get_bd_pins vcnet_i2c_wdt/EXT_MUC_SCLK]
connect_bd_net [get_bd_pins axi_gpio_video/ip2intc_irpt] [get_bd_pins xlconcat_0/In4]
connect_bd_net [get_bd_pins axi_mem_intercon/S00_AXI_awready] [get_bd_pins axi_vdma_0/m_axi_s2mm_awready] [get_bd_pins vcnet_get_dma_addr/AXI_AWREADY]
connect_bd_net [get_bd_pins axi_vdma_0/m_axi_s2mm_awaddr] [get_bd_pins axi_mem_intercon/S00_AXI_awaddr] [get_bd_pins vcnet_get_dma_addr/AXI_AWADDR]
connect_bd_net [get_bd_pins axi_vdma_0/m_axi_s2mm_awvalid] [get_bd_pins axi_mem_intercon/S00_AXI_awvalid] [get_bd_pins vcnet_get_dma_addr/AXI_AWVALID]
connect_bd_net [get_bd_pins axi_vdma_0/mm2s_introut] [get_bd_pins xlconcat_0/In1]
connect_bd_net [get_bd_pins axi_vdma_0/s2mm_introut] [get_bd_pins xlconcat_0/In0]
connect_bd_net -net dvi2rgb_0_PixelClk [get_bd_pins hdmi_in/PixelClk] [get_bd_pins proc_sys_reset_0/slowest_sync_clk]
connect_bd_net -net dvi2rgb_0_pLocked [get_bd_pins hdmi_in/pLocked] \
  [get_bd_pins proc_sys_reset_0/aux_reset_in] [get_bd_pins axi_gpio_video/gpio2_io_i]
connect_bd_net [get_bd_pins hdmi_in/irq] [get_bd_pins xlconcat_0/In3]
connect_bd_net [get_bd_pins hdmi_out/irq] [get_bd_pins xlconcat_0/In2]
connect_bd_net [get_bd_pins proc_sys_reset_0/peripheral_aresetn] [get_bd_pins hdmi_in/resetn]
connect_bd_net [get_bd_pins proc_sys_reset_0/peripheral_reset] [get_bd_pins hdmi_in/vid_io_in_reset]
connect_bd_net [get_bd_pins processing_system7_0/FCLK_CLK0] \
  [get_bd_pins processing_system7_0/M_AXI_GP0_ACLK] [get_bd_pins rst_processing_system7_0_100M/slowest_sync_clk] \
  [get_bd_pins axi_gpio_video/s_axi_aclk] [get_bd_pins axi_vdma_0/s_axi_lite_aclk] [get_bd_pins ps7_0_axi_periph/ACLK] \
  [get_bd_pins ps7_0_axi_periph/S00_ACLK] [get_bd_pins ps7_0_axi_periph/M00_ACLK] [get_bd_pins ps7_0_axi_periph/M01_ACLK] \
  [get_bd_pins ps7_0_axi_periph/M02_ACLK] [get_bd_pins ps7_0_axi_periph/M03_ACLK] [get_bd_pins ps7_0_axi_periph/M04_ACLK] \
  [get_bd_pins ps7_0_axi_periph/M06_ACLK] [get_bd_pins axi_mem_intercon_1/S00_ACLK] \
  [get_bd_pins processing_system7_0/S_AXI_GP0_ACLK] [get_bd_pins axi_mem_intercon_1/M00_ACLK] \
  [get_bd_pins axi_mem_intercon_1/ACLK] [get_bd_pins hdmi_out/s_axi_aclk] [get_bd_pins hdmi_in/s_axi_aclk] \
  [get_bd_pins vcnet_i2c_wdt/CLK] [get_bd_pins ps7_0_axi_periph/M07_ACLK]
connect_bd_net [get_bd_pins processing_system7_0/FCLK_CLK1] \
  [get_bd_pins processing_system7_0/S_AXI_HP0_ACLK] [get_bd_pins rst_processing_system7_0_150M/slowest_sync_clk] \
  [get_bd_pins axi_mem_intercon/ACLK] [get_bd_pins axi_mem_intercon/S00_ACLK] [get_bd_pins axi_mem_intercon/M00_ACLK] \
  [get_bd_pins axi_mem_intercon/S01_ACLK] [get_bd_pins axi_vdma_0/m_axi_mm2s_aclk] [get_bd_pins axi_vdma_0/m_axis_mm2s_aclk] \
  [get_bd_pins axi_vdma_0/m_axi_s2mm_aclk] [get_bd_pins axi_vdma_0/s_axis_s2mm_aclk] [get_bd_pins ps7_0_axi_periph/M05_ACLK] \
  [get_bd_pins hdmi_out/aclk] [get_bd_pins hdmi_in/aclk] [get_bd_pins vcnet_get_dma_addr/CLK]
connect_bd_net [get_bd_pins processing_system7_0/FCLK_CLK2] [get_bd_pins hdmi_in/RefClk]
connect_bd_net [get_bd_pins processing_system7_0/FCLK_RESET0_N] \
  [get_bd_pins proc_sys_reset_0/ext_reset_in] [get_bd_pins rst_processing_system7_0_100M/ext_reset_in] \
  [get_bd_pins rst_processing_system7_0_150M/ext_reset_in]
connect_bd_net -net regs_i2c_master_0_LED [get_bd_pins vcnet_i2c_wdt/LED_0] [get_bd_ports LED_0]
connect_bd_net [get_bd_pins rst_processing_system7_0_100M/interconnect_aresetn] [get_bd_pins ps7_0_axi_periph/ARESETN]
connect_bd_net [get_bd_pins rst_processing_system7_0_100M/peripheral_aresetn] \
  [get_bd_pins axi_gpio_video/s_axi_aresetn] [get_bd_pins axi_vdma_0/axi_resetn] [get_bd_pins ps7_0_axi_periph/S00_ARESETN] \
  [get_bd_pins ps7_0_axi_periph/M00_ARESETN] [get_bd_pins ps7_0_axi_periph/M01_ARESETN] \
  [get_bd_pins ps7_0_axi_periph/M02_ARESETN] [get_bd_pins ps7_0_axi_periph/M03_ARESETN] \
  [get_bd_pins ps7_0_axi_periph/M04_ARESETN] [get_bd_pins ps7_0_axi_periph/M06_ARESETN] \
  [get_bd_pins axi_mem_intercon_1/S00_ARESETN] [get_bd_pins axi_mem_intercon_1/M00_ARESETN] \
  [get_bd_pins axi_mem_intercon_1/ARESETN] [get_bd_pins hdmi_out/s_axi_aresetn] [get_bd_pins hdmi_in/s_axi_aresetn] \
  [get_bd_pins vcnet_i2c_wdt/RESETN] [get_bd_pins ps7_0_axi_periph/M07_ARESETN]
connect_bd_net [get_bd_pins rst_processing_system7_0_150M/interconnect_aresetn] [get_bd_pins axi_mem_intercon/ARESETN]
connect_bd_net [get_bd_pins rst_processing_system7_0_150M/peripheral_aresetn] \
  [get_bd_pins axi_mem_intercon/S00_ARESETN] [get_bd_pins axi_mem_intercon/M00_ARESETN] \
  [get_bd_pins axi_mem_intercon/S01_ARESETN] [get_bd_pins ps7_0_axi_periph/M05_ARESETN] \
  [get_bd_pins vcnet_get_dma_addr/RESETN] [get_bd_pins hdmi_in/ap_rst_n]
connect_bd_net -net vcnet_i2c_wdt_DOUT_0 [get_bd_pins vcnet_i2c_wdt/EXT_MCU_DOUT] [get_bd_ports EXT_MCU_DOUT]
connect_bd_net [get_bd_pins vcnet_i2c_wdt/IR_OUT_0] [get_bd_ports IR_OUT_0]
connect_bd_net [get_bd_pins xlconcat_0/dout] [get_bd_pins processing_system7_0/IRQ_F2P]

# ---- address map ----
assign_bd_address -offset 0x00000000 -range 512M -target_address_space [get_bd_addr_spaces axi_vdma_0/Data_MM2S] [get_bd_addr_segs processing_system7_0/S_AXI_HP0/HP0_DDR_LOWOCM]
assign_bd_address -offset 0x00000000 -range 512M -target_address_space [get_bd_addr_spaces axi_vdma_0/Data_S2MM] [get_bd_addr_segs processing_system7_0/S_AXI_HP0/HP0_DDR_LOWOCM]
assign_bd_address -offset 0x41200000 -range 64K -target_address_space [get_bd_addr_spaces processing_system7_0/Data] [get_bd_addr_segs axi_gpio_video/S_AXI/Reg]
assign_bd_address -offset 0x43000000 -range 64K -target_address_space [get_bd_addr_spaces processing_system7_0/Data] [get_bd_addr_segs axi_vdma_0/S_AXI_LITE/Reg]
assign_bd_address -offset 0x43C00000 -range 64K -target_address_space [get_bd_addr_spaces processing_system7_0/Data] [get_bd_addr_segs hdmi_out/axi_dynclk_0/S_AXI_LITE/S_AXI_LITE_reg]
assign_bd_address -offset 0x43C10000 -range 64K -target_address_space [get_bd_addr_spaces processing_system7_0/Data] [get_bd_addr_segs hdmi_out/v_tc_out/ctrl/Reg]
assign_bd_address -offset 0x43C20000 -range 64K -target_address_space [get_bd_addr_spaces processing_system7_0/Data] [get_bd_addr_segs hdmi_in/v_tc_in/ctrl/Reg]
assign_bd_address -offset 0x43C30000 -range 64K -target_address_space [get_bd_addr_spaces processing_system7_0/Data] [get_bd_addr_segs vcnet_get_dma_addr/axilite_regs_0/s_axi_AXILiteS/reg0]
assign_bd_address -offset 0x43C40000 -range 64K -target_address_space [get_bd_addr_spaces processing_system7_0/Data] [get_bd_addr_segs vcnet_i2c_wdt/axilite_regs_i2c/s_axi_AXILiteS/reg0]
assign_bd_address -offset 0x43C50000 -range 64K -target_address_space [get_bd_addr_spaces processing_system7_0/Data] [get_bd_addr_segs vcnet_i2c_wdt/axilite_regs_spi/s_axi_AXILiteS/reg0]
assign_bd_address -offset 0x00000000 -range 512M -target_address_space [get_bd_addr_spaces vcnet_i2c_wdt/block_aximaster_0/interface_aximm] [get_bd_addr_segs processing_system7_0/S_AXI_GP0/GP0_DDR_LOWOCM]
assign_bd_address -offset 0x40000000 -range 1G -target_address_space [get_bd_addr_spaces vcnet_i2c_wdt/block_aximaster_0/interface_aximm] [get_bd_addr_segs processing_system7_0/S_AXI_GP0/GP0_M_AXI_GP0]
assign_bd_address -offset 0xE0000000 -range 4M -target_address_space [get_bd_addr_spaces vcnet_i2c_wdt/block_aximaster_0/interface_aximm] [get_bd_addr_segs processing_system7_0/S_AXI_GP0/GP0_IOP]
assign_bd_address -offset 0xFC000000 -range 16M -target_address_space [get_bd_addr_spaces vcnet_i2c_wdt/block_aximaster_0/interface_aximm] [get_bd_addr_segs processing_system7_0/S_AXI_GP0/GP0_QSPI_LINEAR]

validate_bd_design
save_bd_design
